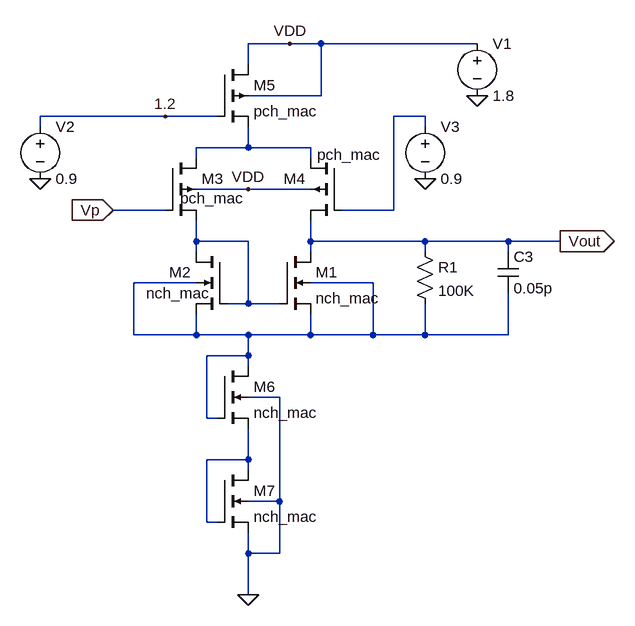
[diagram p0: schematic RNN_Sigmoid4_HA.asc]
RNN_Sigmoid4_HA.asc, the LTspice schematic file:
Version 4
SHEET 1 880 724
WIRE 288 -144 224 -144
WIRE 336 -144 288 -144
WIRE 576 -144 336 -144
WIRE 224 -112 224 -144
WIRE 336 -64 336 -144
WIRE 336 -64 224 -64
WIRE 96 -32 -96 -32
WIRE 176 -32 96 -32
WIRE 496 -32 448 -32
WIRE -96 -16 -96 -32
WIRE 496 -16 496 -32
WIRE 224 16 224 -16
WIRE 224 16 144 16
WIRE 320 16 224 16
WIRE 144 32 144 16
WIRE 320 32 320 16
WIRE 224 80 144 80
WIRE 320 80 224 80
WIRE 96 112 16 112
WIRE 448 112 448 -32
WIRE 448 112 368 112
WIRE 144 160 144 128
WIRE 224 160 144 160
WIRE 320 160 320 128
WIRE 496 160 320 160
WIRE 624 160 496 160
WIRE 704 160 624 160
WIRE 144 176 144 160
WIRE 320 176 320 160
WIRE 496 176 496 160
WIRE 624 176 624 160
WIRE 144 224 48 224
WIRE 416 224 320 224
WIRE 224 256 224 160
WIRE 224 256 192 256
WIRE 272 256 224 256
WIRE 48 304 48 224
WIRE 144 304 144 272
WIRE 144 304 48 304
WIRE 224 304 144 304
WIRE 320 304 320 272
WIRE 320 304 224 304
WIRE 416 304 416 224
WIRE 416 304 320 304
WIRE 496 304 496 256
WIRE 496 304 416 304
WIRE 624 304 624 240
WIRE 624 304 496 304
WIRE 224 336 224 304
WIRE 224 336 160 336
WIRE 224 352 224 336
WIRE 272 400 224 400
WIRE 160 432 160 336
WIRE 176 432 160 432
WIRE 224 496 224 448
WIRE 224 496 160 496
WIRE 224 512 224 496
WIRE 272 560 272 400
WIRE 272 560 224 560
WIRE 160 592 160 496
WIRE 176 592 160 592
WIRE 224 640 224 608
WIRE 272 640 272 560
WIRE 272 640 224 640
WIRE 224 704 224 640
FLAG 96 -32 1.2
FLAG 704 160 Vout
IOPIN 704 160 Out
FLAG 16 112 Vp
IOPIN 16 112 In
FLAG 224 80 VDD
FLAG 288 -144 VDD
FLAG -96 64 0
FLAG 576 -64 0
FLAG 224 704 0
FLAG 496 64 0
SYMBOL nmos4 272 176 R0
SYMATTR InstName M1
SYMATTR Value nch_mac
SYMATTR Value2 l=2u w=1u
SYMBOL nmos4 192 176 M0
WINDOW 3 27 64 Left 2
SYMATTR Value nch_mac
SYMATTR InstName M2
SYMATTR Value2 l=2u w=1u
SYMBOL pmos4 96 32 R0
WINDOW 3 23 62 Left 2
SYMATTR Value pch_mac
SYMATTR InstName M3
SYMATTR Value2 l=3u w=4u
SYMBOL pmos4 368 32 M0
WINDOW 3 -60 -5 Left 2
SYMATTR Value pch_mac
SYMATTR InstName M4
SYMATTR Value2 l=3u w=4u
SYMBOL pmos4 176 -112 R0
SYMATTR InstName M5
SYMATTR Value pch_mac
SYMATTR Value2 l=2u w=5.7u
SYMBOL res 480 160 R0
SYMATTR InstName R1
SYMATTR Value 100K
SYMBOL voltage 576 -160 R0
WINDOW 123 0 0 Left 0
WINDOW 39 0 0 Left 0
SYMATTR InstName V1
SYMATTR Value 1.8
SYMBOL voltage -96 -32 R0
WINDOW 123 0 0 Left 0
WINDOW 39 0 0 Left 0
SYMATTR InstName V2
SYMATTR Value 0.9
SYMBOL voltage 496 -32 R0
WINDOW 123 0 0 Left 0
WINDOW 39 0 0 Left 0
SYMATTR InstName V3
SYMATTR Value 0.9
SYMBOL cap 608 176 R0
SYMATTR InstName C3
SYMATTR Value 0.05p
SYMBOL nmos4 176 352 R0
SYMATTR InstName M6
SYMATTR Value nch_mac
SYMATTR Value2 l=2u w=5u m=15
SYMBOL nmos4 176 512 R0
SYMATTR InstName M7
SYMATTR Value nch_mac
SYMATTR Value2 l=2u w=5u m=15

The netlist it stands for:
* RNN_Sigmoid4_HA.asc
M1 Vout N003 N004 N004 nch_mac l=2u w=1u
M2 N003 N003 N004 N004 nch_mac l=2u w=1u
M3 N002 Vp N003 VDD pch_mac l=3u w=4u
M4 N002 N001 Vout VDD pch_mac l=3u w=4u
M5 VDD 1.2 N002 VDD pch_mac l=2u w=5.7u
R1 Vout N004 100K
V1 VDD 0 1.8
V2 1.2 0 0.9
V3 N001 0 0.9
C3 Vout N004 0.05p
M6 N004 N004 N005 0 nch_mac l=2u w=5u m=15
M7 N005 N005 0 0 nch_mac l=2u w=5u m=15
.model NMOS NMOS
.model PMOS PMOS
.lib standard.mos
.backanno
.end